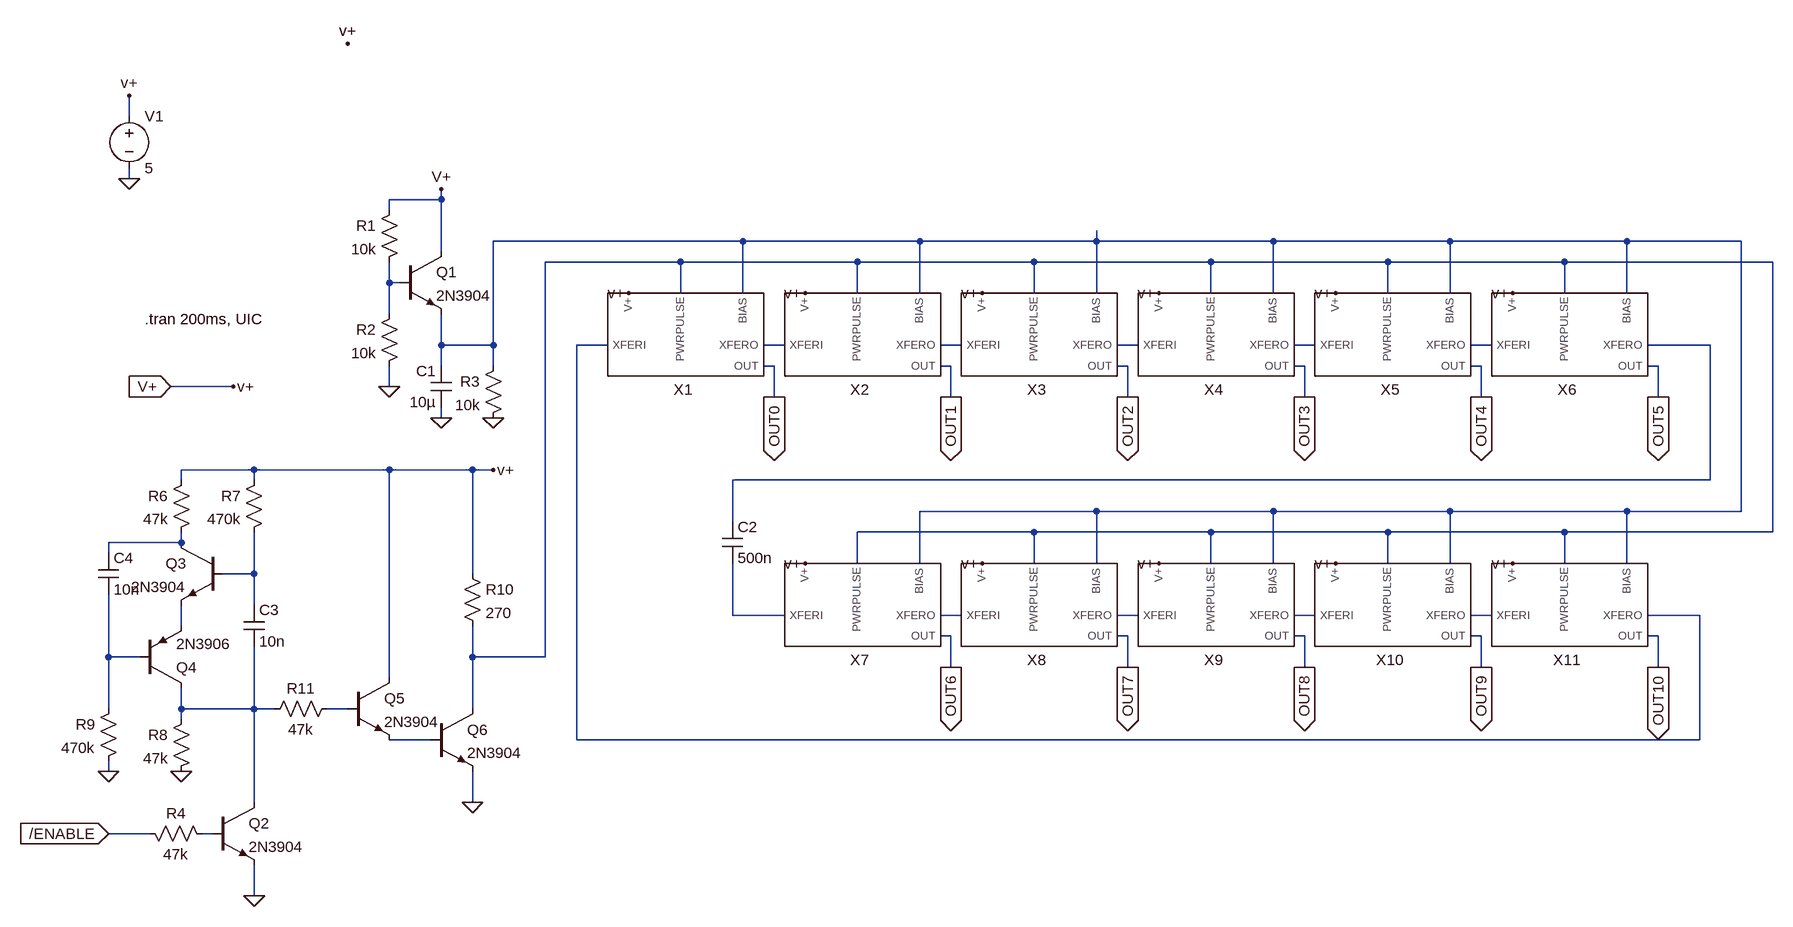
[diagram p0: schematic UART-TX-RingCounter.asc]
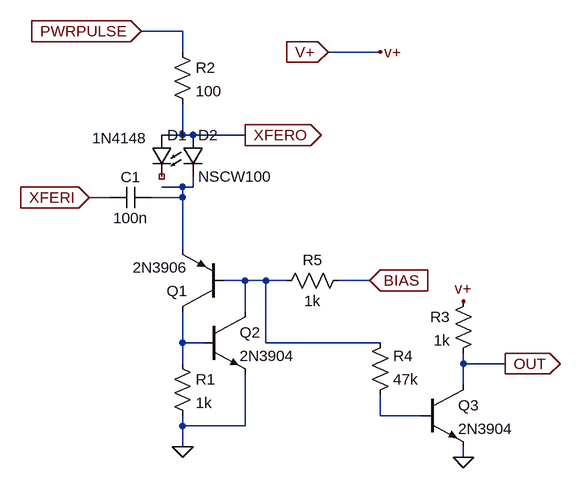
[diagram p1: sub-circuit ringcounter1.asc]
UART-TX-RingCounter.asc, the LTspice schematic file:
Version 4
SHEET 1 1844 1568
WIRE -688 -224 -688 -256
WIRE -688 -128 -688 -144
WIRE -208 -96 -208 -112
WIRE -208 -96 -288 -96
WIRE -288 -80 -288 -96
WIRE 256 -32 -128 -32
WIRE 528 -32 256 -32
WIRE 800 -32 800 -48
WIRE 800 -32 528 -32
WIRE 1072 -32 800 -32
WIRE 1344 -32 1072 -32
WIRE 1616 -32 1344 -32
WIRE 1792 -32 1616 -32
WIRE -208 -16 -208 -96
WIRE 160 0 -48 0
WIRE 432 0 160 0
WIRE 704 0 432 0
WIRE 976 0 704 0
WIRE 1248 0 976 0
WIRE 1520 0 1248 0
WIRE 1840 0 1520 0
WIRE -288 32 -288 0
WIRE -272 32 -288 32
WIRE 160 48 160 0
WIRE 256 48 256 -32
WIRE 432 48 432 0
WIRE 528 48 528 -32
WIRE 704 48 704 0
WIRE 800 48 800 -32
WIRE 976 48 976 0
WIRE 1072 48 1072 -32
WIRE 1248 48 1248 0
WIRE 1344 48 1344 -32
WIRE 1520 48 1520 0
WIRE 1616 48 1616 -32
WIRE -288 80 -288 32
WIRE -208 128 -208 80
WIRE -128 128 -128 -32
WIRE -128 128 -208 128
WIRE 48 128 0 128
WIRE 320 128 288 128
WIRE 592 128 560 128
WIRE 864 128 832 128
WIRE 1136 128 1104 128
WIRE 1408 128 1376 128
WIRE 1744 128 1648 128
WIRE -208 160 -208 128
WIRE -128 160 -128 128
WIRE 304 160 288 160
WIRE 576 160 560 160
WIRE 848 160 832 160
WIRE 1120 160 1104 160
WIRE 1392 160 1376 160
WIRE 1664 160 1648 160
WIRE -528 192 -624 192
WIRE -288 192 -288 160
WIRE 304 208 304 160
WIRE 576 208 576 160
WIRE 848 208 848 160
WIRE 1120 208 1120 160
WIRE 1392 208 1392 160
WIRE 1664 208 1664 160
WIRE -208 240 -208 224
WIRE -496 320 -608 320
WIRE -288 320 -496 320
WIRE -160 320 -288 320
WIRE -128 320 -160 320
WIRE -608 336 -608 320
WIRE -496 336 -496 320
WIRE 1744 336 1744 128
WIRE 1744 336 240 336
WIRE 800 384 528 384
WIRE 1072 384 800 384
WIRE 1344 384 1072 384
WIRE 1616 384 1344 384
WIRE 1792 384 1792 -32
WIRE 1792 384 1616 384
WIRE 240 400 240 336
WIRE 704 416 432 416
WIRE 976 416 704 416
WIRE 1248 416 976 416
WIRE 1520 416 1248 416
WIRE 1840 416 1840 0
WIRE 1840 416 1520 416
WIRE -608 432 -608 416
WIRE -608 432 -720 432
WIRE -720 448 -720 432
WIRE 432 464 432 416
WIRE 528 464 528 384
WIRE 704 464 704 416
WIRE 800 464 800 384
WIRE 976 464 976 416
WIRE 1072 464 1072 384
WIRE 1248 464 1248 416
WIRE 1344 464 1344 384
WIRE 1520 464 1520 416
WIRE 1616 464 1616 384
WIRE -496 480 -496 416
WIRE -496 480 -544 480
WIRE -160 480 -160 320
WIRE -496 528 -496 480
WIRE 240 544 240 464
WIRE 320 544 240 544
WIRE 592 544 560 544
WIRE 864 544 832 544
WIRE 1136 544 1104 544
WIRE 1408 544 1376 544
WIRE 1728 544 1648 544
WIRE -608 560 -608 528
WIRE 576 576 560 576
WIRE 848 576 832 576
WIRE 1120 576 1104 576
WIRE 1392 576 1376 576
WIRE 1664 576 1648 576
WIRE -720 608 -720 512
WIRE -672 608 -720 608
WIRE -160 608 -160 560
WIRE -48 608 -48 0
WIRE -48 608 -160 608
WIRE 576 624 576 576
WIRE 848 624 848 576
WIRE 1120 624 1120 576
WIRE 1392 624 1392 576
WIRE 1664 624 1664 576
WIRE -288 640 -288 320
WIRE -720 688 -720 608
WIRE -608 688 -608 656
WIRE -496 688 -496 592
WIRE -496 688 -608 688
WIRE -464 688 -496 688
WIRE -352 688 -384 688
WIRE -160 688 -160 608
WIRE -608 704 -608 688
WIRE -224 736 -288 736
WIRE 0 736 0 128
WIRE 1728 736 1728 544
WIRE 1728 736 0 736
WIRE -720 784 -720 768
WIRE -496 832 -496 688
WIRE -160 832 -160 784
WIRE -656 880 -720 880
WIRE -560 880 -576 880
WIRE -496 976 -496 928
FLAG -288 192 0
FLAG -208 -112 V+
FLAG -128 240 0
FLAG -208 240 0
FLAG 80 48 v+
FLAG 352 48 v+
FLAG 624 48 v+
FLAG 896 48 v+
FLAG 1168 48 v+
FLAG 1440 48 v+
FLAG 352 464 v+
FLAG 624 464 v+
FLAG 896 464 v+
FLAG 1168 464 v+
FLAG 1440 464 v+
FLAG 304 208 OUT0
IOPIN 304 208 Out
FLAG 576 208 OUT1
IOPIN 576 208 Out
FLAG 848 208 OUT2
IOPIN 848 208 Out
FLAG 1120 208 OUT3
IOPIN 1120 208 Out
FLAG 1392 208 OUT4
IOPIN 1392 208 Out
FLAG 1664 208 OUT5
IOPIN 1664 208 Out
FLAG 576 624 OUT6
IOPIN 576 624 Out
FLAG 848 624 OUT7
IOPIN 848 624 Out
FLAG 1120 624 OUT8
IOPIN 1120 624 Out
FLAG 1392 624 OUT9
IOPIN 1392 624 Out
FLAG 1664 624 OUT10
IOPIN 1664 624 Out
FLAG -608 784 0
FLAG -720 784 0
FLAG -128 320 v+
FLAG -160 832 0
FLAG -496 976 0
FLAG -720 880 /ENABLE
IOPIN -720 880 In
FLAG -528 192 v+
FLAG -624 192 V+
IOPIN -624 192 In
FLAG -688 -128 0
FLAG -688 -256 v+
FLAG -352 -336 v+
FLAG -352 -336 v+
SYMBOL npn -272 -16 R0
SYMATTR InstName Q1
SYMATTR Value 2N3904
SYMBOL res -272 -96 M0
SYMATTR InstName R1
SYMATTR Value 10k
SYMBOL res -272 64 M0
SYMATTR InstName R2
SYMATTR Value 10k
SYMBOL res -112 144 M0
SYMATTR InstName R3
SYMATTR Value 10k
SYMBOL cap -192 160 M0
SYMATTR InstName C1
SYMATTR Value 10µ
SYMBOL RingCounter1 160 112 R0
SYMATTR InstName X1
SYMBOL RingCounter1 432 112 R0
SYMATTR InstName X2
SYMBOL RingCounter1 704 112 R0
SYMATTR InstName X3
SYMBOL RingCounter1 976 112 R0
SYMATTR InstName X4
SYMBOL RingCounter1 1248 112 R0
SYMATTR InstName X5
SYMBOL RingCounter1 1520 112 R0
SYMATTR InstName X6
SYMBOL RingCounter1 432 528 R0
SYMATTR InstName X7
SYMBOL RingCounter1 704 528 R0
SYMATTR InstName X8
SYMBOL RingCounter1 976 528 R0
SYMATTR InstName X9
SYMBOL RingCounter1 1248 528 R0
SYMATTR InstName X10
SYMBOL RingCounter1 1520 528 R0
SYMATTR InstName X11
SYMBOL cap 224 400 R0
SYMATTR InstName C2
SYMATTR Value 500n
SYMBOL npn -544 432 M0
SYMATTR InstName Q3
SYMATTR Value 2N3904
SYMBOL res -592 320 M0
SYMATTR InstName R6
SYMATTR Value 47k
SYMBOL res -480 320 M0
SYMATTR InstName R7
SYMATTR Value 470k
SYMBOL cap -512 592 M180
WINDOW 0 24 56 Left 2
WINDOW 3 24 8 Left 2
SYMATTR InstName C3
SYMATTR Value 10n
SYMBOL cap -736 512 M180
WINDOW 0 24 56 Left 2
WINDOW 3 24 8 Left 2
SYMATTR InstName C4
SYMATTR Value 10n
SYMBOL res -592 688 M0
SYMATTR InstName R8
SYMATTR Value 47k
SYMBOL res -704 672 M0
SYMATTR InstName R9
SYMATTR Value 470k
SYMBOL pnp -672 656 M180
SYMATTR InstName Q4
SYMATTR Value 2N3906
SYMBOL npn -352 640 R0
SYMATTR InstName Q5
SYMATTR Value 2N3904
SYMBOL res -176 464 R0
SYMATTR InstName R10
SYMATTR Value 270
SYMBOL res -368 672 R90
WINDOW 0 0 56 VBottom 2
WINDOW 3 32 56 VTop 2
SYMATTR InstName R11
SYMATTR Value 47k
SYMBOL npn -224 688 R0
SYMATTR InstName Q6
SYMATTR Value 2N3904
SYMBOL npn -560 832 R0
SYMATTR InstName Q2
SYMATTR Value 2N3904
SYMBOL res -672 864 M90
WINDOW 0 0 56 VBottom 2
WINDOW 3 32 56 VTop 2
SYMATTR InstName R4
SYMATTR Value 47k
SYMBOL voltage -688 -240 R0
SYMATTR InstName V1
SYMATTR Value 5
TEXT -664 88 Left 2 !.tran 200ms, UIC

ringcounter1.asc, the sub-circuit schematic file:
Version 4
SHEET 1 892 832
WIRE 288 -128 224 -128
WIRE 288 -96 288 -128
WIRE 592 -96 512 -96
WIRE 288 32 288 -16
WIRE 288 32 256 32
WIRE 304 32 288 32
WIRE 384 32 304 32
WIRE 288 112 256 112
WIRE 304 112 304 96
WIRE 304 112 288 112
WIRE 176 128 144 128
WIRE 288 128 288 112
WIRE 288 128 240 128
WIRE 288 208 288 128
WIRE 384 256 352 256
WIRE 416 256 384 256
WIRE 448 256 416 256
WIRE 576 256 528 256
WIRE 384 304 384 256
WIRE 288 352 288 304
WIRE 320 352 288 352
WIRE 416 352 416 256
WIRE 592 352 416 352
WIRE 288 384 288 352
WIRE 720 384 720 368
WIRE 784 384 720 384
WIRE 720 416 720 384
WIRE 592 464 592 432
WIRE 656 464 592 464
WIRE 288 480 288 464
WIRE 384 480 384 400
WIRE 384 480 288 480
WIRE 288 512 288 480
WIRE 720 528 720 512
FLAG 288 512 0
FLAG 720 528 0
FLAG 720 288 v+
FLAG 784 384 OUT
IOPIN 784 384 Out
FLAG 576 256 BIAS
IOPIN 576 256 In
FLAG 144 128 XFERI
IOPIN 144 128 In
FLAG 384 32 XFERO
IOPIN 384 32 Out
FLAG 224 -128 PWRPULSE
IOPIN 224 -128 In
FLAG 512 -96 V+
IOPIN 512 -96 In
FLAG 592 -96 v+
SYMBOL pnp 352 304 R180
SYMATTR InstName Q1
SYMATTR Value 2N3906
SYMBOL npn 320 304 R0
SYMATTR InstName Q2
SYMATTR Value 2N3904
SYMBOL res 272 368 R0
SYMATTR InstName R1
SYMATTR Value 1k
SYMBOL res 272 -112 R0
SYMATTR InstName R2
SYMATTR Value 100
SYMBOL cap 240 112 R90
WINDOW 0 0 32 VBottom 2
WINDOW 3 32 32 VTop 2
SYMATTR InstName C1
SYMATTR Value 100n
SYMBOL diode 240 32 R0
WINDOW 3 -91 5 Left 2
SYMATTR InstName D1
SYMATTR Value 1N4148
SYMBOL npn 656 416 R0
SYMATTR InstName Q3
SYMATTR Value 2N3904
SYMBOL res 736 272 M0
SYMATTR InstName R3
SYMATTR Value 1k
SYMBOL res 576 448 M180
WINDOW 0 36 76 Left 2
WINDOW 3 36 40 Left 2
SYMATTR InstName R4
SYMATTR Value 47k
SYMBOL res 544 240 R90
WINDOW 0 0 56 VBottom 2
WINDOW 3 32 56 VTop 2
SYMATTR InstName R5
SYMATTR Value 1k
SYMBOL LED 288 32 R0
SYMATTR InstName D2
SYMATTR Value NSCW100

The netlist it stands for:
* UART-TX-RingCounter.asc
Q1 V+ N003 N001 0 2N3904
R1 V+ N003 10k
R2 N003 0 10k
R3 N001 0 10k
C1 N001 0 10µ
XX1 N001 N002 V+ N004 OUT0 N005 ringcounter1
XX2 N001 N002 V+ N005 OUT1 N006 ringcounter1
XX3 N001 N002 V+ N006 OUT2 N007 ringcounter1
XX4 N001 N002 V+ N007 OUT3 N008 ringcounter1
XX5 N001 N002 V+ N008 OUT4 N009 ringcounter1
XX6 N001 N002 V+ N009 OUT5 N010 ringcounter1
XX7 N001 N002 V+ N013 OUT6 N014 ringcounter1
XX8 N001 N002 V+ N014 OUT7 N015 ringcounter1
XX9 N001 N002 V+ N015 OUT8 N016 ringcounter1
XX10 N001 N002 V+ N016 OUT9 N017 ringcounter1
XX11 N001 N002 V+ N017 OUT10 N004 ringcounter1
C2 N010 N013 500n
Q3 N011 N012 N018 0 2N3904
R6 V+ N011 47k
R7 V+ N012 470k
C3 N020 N012 10n
C4 N019 N011 10n
R8 N020 0 47k
R9 N019 0 470k
Q4 N020 N019 N018 0 2N3906
Q5 V+ N021 N022 0 2N3904
R10 V+ N002 270
R11 N021 N020 47k
Q6 N002 N022 0 0 2N3904
Q2 N020 N023 0 0 2N3904
R4 /ENABLE N023 47k
V1 V+ 0 5

* block symbol definitions
.subckt ringcounter1 BIAS PWRPULSE V+ XFERI OUT XFERO
Q1 N003 N002 N001 0 2N3906
Q2 N002 N003 0 0 2N3904
R1 N003 0 1k
R2 PWRPULSE XFERO 100
C1 N001 XFERI 100n
D1 XFERO NC_01 1N4148
Q3 OUT N004 0 0 2N3904
R3 v+ OUT 1k
R4 N004 N002 47k
R5 BIAS N002 1k
D2 XFERO N001 NSCW100
.ends ringcounter1

.model D D
.lib standard.dio
.model NPN NPN
.model PNP PNP
.lib standard.bjt
.tran 200ms, UIC
.backanno
.end